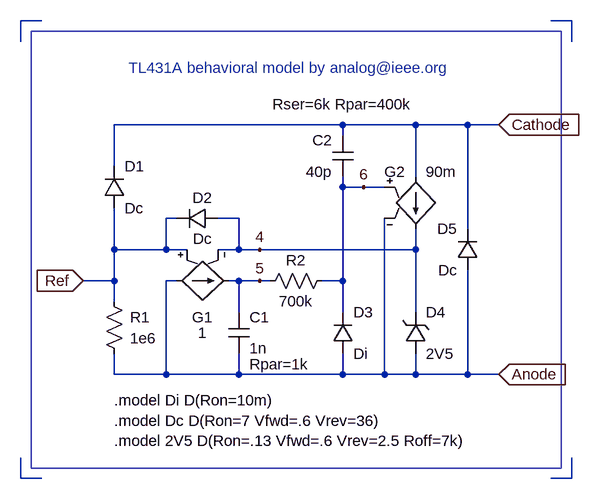
[diagram p0: schematic TL431A.asc]
TL431A.asc, the LTspice schematic file:
Version 4
SHEET 1 1024 680
WIRE 128 -432 128 -464
WIRE 128 240 128 208
WIRE 160 -464 128 -464
WIRE 160 240 128 240
WIRE 272 -240 272 -304
WIRE 272 -112 272 -176
WIRE 272 -64 224 -64
WIRE 272 -64 272 -112
WIRE 272 -32 272 -64
WIRE 272 80 272 48
WIRE 352 -112 272 -112
WIRE 352 -112 352 -160
WIRE 352 80 272 80
WIRE 352 80 352 -64
WIRE 368 -160 352 -160
WIRE 368 -64 352 -64
WIRE 384 -112 352 -112
WIRE 464 -160 432 -160
WIRE 464 -112 432 -112
WIRE 464 -112 464 -160
WIRE 464 -64 448 -64
WIRE 464 -16 464 -64
WIRE 464 80 352 80
WIRE 464 80 464 48
WIRE 496 -112 464 -112
WIRE 496 -64 464 -64
WIRE 512 -64 496 -64
WIRE 624 -304 272 -304
WIRE 624 -288 624 -304
WIRE 624 -208 624 -224
WIRE 624 -64 592 -64
WIRE 624 -64 624 -208
WIRE 624 -16 624 -64
WIRE 624 80 464 80
WIRE 624 80 624 48
WIRE 656 -208 624 -208
WIRE 688 -208 656 -208
WIRE 688 80 624 80
WIRE 688 80 688 -160
WIRE 736 -304 624 -304
WIRE 736 -224 736 -304
WIRE 736 -112 496 -112
WIRE 736 -112 736 -144
WIRE 736 -16 736 -112
WIRE 736 80 688 80
WIRE 736 80 736 48
WIRE 816 -304 736 -304
WIRE 816 -144 816 -304
WIRE 816 80 736 80
WIRE 816 80 816 -80
WIRE 864 -304 816 -304
WIRE 864 80 816 80
WIRE 976 -464 944 -464
WIRE 976 -432 976 -464
WIRE 976 240 944 240
WIRE 976 240 976 208
FLAG 224 -64 Ref
IOPIN 224 -64 In
FLAG 864 -304 Cathode
IOPIN 864 -304 In
FLAG 864 80 Anode
IOPIN 864 80 In
FLAG 496 -112 4
FLAG 496 -64 5
FLAG 656 -208 6
SYMBOL res 256 -48 R0
WINDOW 0 40 40 Left 0
WINDOW 3 40 72 Left 0
SYMATTR InstName R1
SYMATTR Value 1e6
SYMBOL zener 720 48 M180
WINDOW 0 32 64 Left 0
WINDOW 3 32 0 Left 0
SYMATTR InstName D4
SYMATTR Value 2V5
SYMATTR Description Diode
SYMATTR Type diode
SYMBOL diode 832 -80 R180
WINDOW 0 32 64 Left 0
WINDOW 3 32 0 Left 0
SYMATTR InstName D5
SYMATTR Value Dc
SYMBOL diode 256 -176 M180
WINDOW 0 32 64 Left 0
WINDOW 3 32 0 Left 0
SYMATTR InstName D1
SYMATTR Value Dc
SYMBOL g2 736 -128 M180
WINDOW 0 -16 104 Right 0
WINDOW 3 16 104 Left 0
SYMATTR InstName G2
SYMATTR Value 90m
SYMBOL g2 464 -64 R90
WINDOW 0 56 56 VCenter 0
WINDOW 3 80 56 VCenter 0
SYMATTR InstName G1
SYMATTR Value 1
SYMBOL cap 448 -16 R0
WINDOW 0 32 8 Left 0
WINDOW 3 32 56 Left 0
WINDOW 39 32 80 Left 0
SYMATTR InstName C1
SYMATTR Value 1n
SYMATTR SpiceLine Rpar=1k
SYMBOL res 608 -80 R90
WINDOW 0 0 56 VBottom 0
WINDOW 3 32 56 VTop 0
SYMATTR InstName R2
SYMATTR Value 700k
SYMBOL diode 432 -176 R90
WINDOW 0 0 24 VBottom 0
WINDOW 3 32 24 VTop 0
SYMATTR InstName D2
SYMATTR Value Dc
SYMBOL diode 608 48 M180
WINDOW 0 32 64 Left 0
WINDOW 3 32 0 Left 0
SYMATTR InstName D3
SYMATTR Value Di
SYMBOL cap 640 -288 M0
WINDOW 0 32 8 Left 0
WINDOW 3 32 56 Left 0
WINDOW 39 16 -32 Bottom 0
SYMATTR InstName C2
SYMATTR Value 40p
SYMATTR SpiceLine Rser=6k Rpar=400k
TEXT 272 120 Left 0 !.model Di D(Ron=10m)\n.model Dc D(Ron=7 Vfwd=.6 Vrev=36)\n.model 2V5 D(Ron=.13 Vfwd=.6 Vrev=2.5 Roff=7k)
TEXT 544 -392 Center 0 ;TL431A behavioral model by analog@ieee.org
RECTANGLE Normal 960 224 144 -448

The netlist it stands for:
* TL431A.asc
R1 Ref Anode 1e6
D4 Anode 4 2V5
D5 Anode Cathode Dc
D1 Ref Cathode Dc
G2 Cathode 4 6 Anode 90m
G1 Anode 5 Ref 4 1
C1 5 Anode 1n Rpar=1k
R2 6 5 700k
D2 4 Ref Dc
D3 Anode 6 Di
C2 Cathode 6 40p Rser=6k Rpar=400k
.model D D
.lib standard.dio
.model Di D(Ron=10m)
.model Dc D(Ron=7 Vfwd=.6 Vrev=36)
.model 2V5 D(Ron=.13 Vfwd=.6 Vrev=2.5 Roff=7k)
* TL431A behavioral model by analog@ieee.org
.backanno
.end